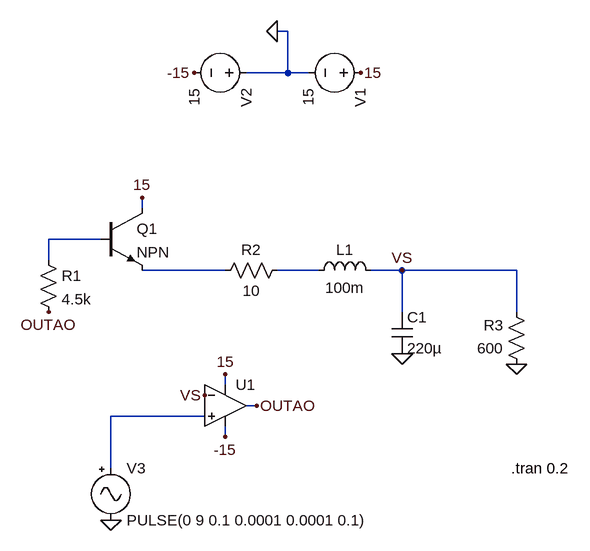
[diagram p0: schematic ActividadReto1.asc]
ActividadReto1.asc, the LTspice schematic file:
Version 4.1
SHEET 1 992 792
WIRE 544 16 528 16
WIRE 544 80 544 16
WIRE 544 80 480 80
WIRE 576 80 544 80
WIRE 320 288 320 272
WIRE 256 336 176 336
WIRE 176 368 176 336
WIRE 448 384 320 384
WIRE 592 384 528 384
WIRE 720 384 672 384
WIRE 896 384 720 384
WIRE 720 448 720 384
WIRE 896 448 896 384
WIRE 448 560 448 544
WIRE 496 592 480 592
WIRE 416 608 272 608
WIRE 448 640 448 624
WIRE 272 688 272 608
FLAG 528 16 0
FLAG 656 80 15
FLAG 400 80 -15
FLAG 272 768 0
FLAG 496 592 OUTAO
FLAG 176 448 OUTAO
FLAG 320 272 15
FLAG 448 544 15
FLAG 448 640 -15
FLAG 720 384 VS
FLAG 416 576 VS
FLAG 720 512 0
FLAG 896 528 0
SYMBOL OpAmps\\UniversalOpAmp2 448 592 R0
SYMATTR InstName U1
SYMBOL npn 256 288 R0
SYMATTR InstName Q1
SYMBOL voltage 672 80 R90
WINDOW 123 0 0 Left 0
WINDOW 39 0 0 Left 0
SYMATTR InstName V1
SYMATTR Value 15
SYMBOL voltage 496 80 R90
WINDOW 123 0 0 Left 0
WINDOW 39 0 0 Left 0
SYMATTR InstName V2
SYMATTR Value 15
SYMBOL res 160 352 R0
SYMATTR InstName R1
SYMATTR Value 4.5k
SYMBOL res 544 368 R90
WINDOW 0 0 56 VBottom 2
WINDOW 3 32 56 VTop 2
SYMATTR InstName R2
SYMATTR Value 10
SYMBOL res 912 544 R180
WINDOW 0 36 76 Left 2
WINDOW 3 36 40 Left 2
SYMATTR InstName R3
SYMATTR Value 600
SYMBOL Misc\\signal 272 672 R0
SYMATTR InstName V3
SYMATTR Value PULSE(0 9 0.1 0.0001 0.0001 0.1)
SYMBOL ind 576 400 R270
WINDOW 0 32 56 VTop 2
WINDOW 3 5 56 VBottom 2
SYMATTR InstName L1
SYMATTR Value 100m
SYMBOL cap 704 448 R0
SYMATTR InstName C1
SYMATTR Value 220µ
TEXT 888 688 Left 2 !.tran 0.2

The netlist it stands for:
* ActividadReto1.asc
X§U1 N004 VS 15 -15 OUTAO level2 Avol=1Meg GBW=10Meg Slew=10Meg Ilimit=25m Rail=0 Vos=0 En=0 Enk=0 In=0 Ink=0 Rin=500Meg  ; pins In+ In- V+ V- OUT
Q1 15 N001 N002 0 NPN
V1 15 0 15
V2 0 -15 15
R1 N001 OUTAO 4.5k
R2 N003 N002 10
R3 0 VS 600
V3 N004 0 PULSE(0 9 0.1 0.0001 0.0001 0.1)
L1 N003 VS 100m
C1 VS 0 220µ
.model NPN NPN
.model PNP PNP
.lib standard.bjt
.tran 0.2
.lib UniversalOpAmp2.lib
.backanno
.end